# Altium schematic sheet MicroSpecSensorBoard_Connectors_V2_1.SchDoc: Extension connectors
size A4; DocumentNumber: MB1136; Revision: C.3; SheetNumber: 4; SheetTotal: 4; Project: NUCLEO-XXXXRX
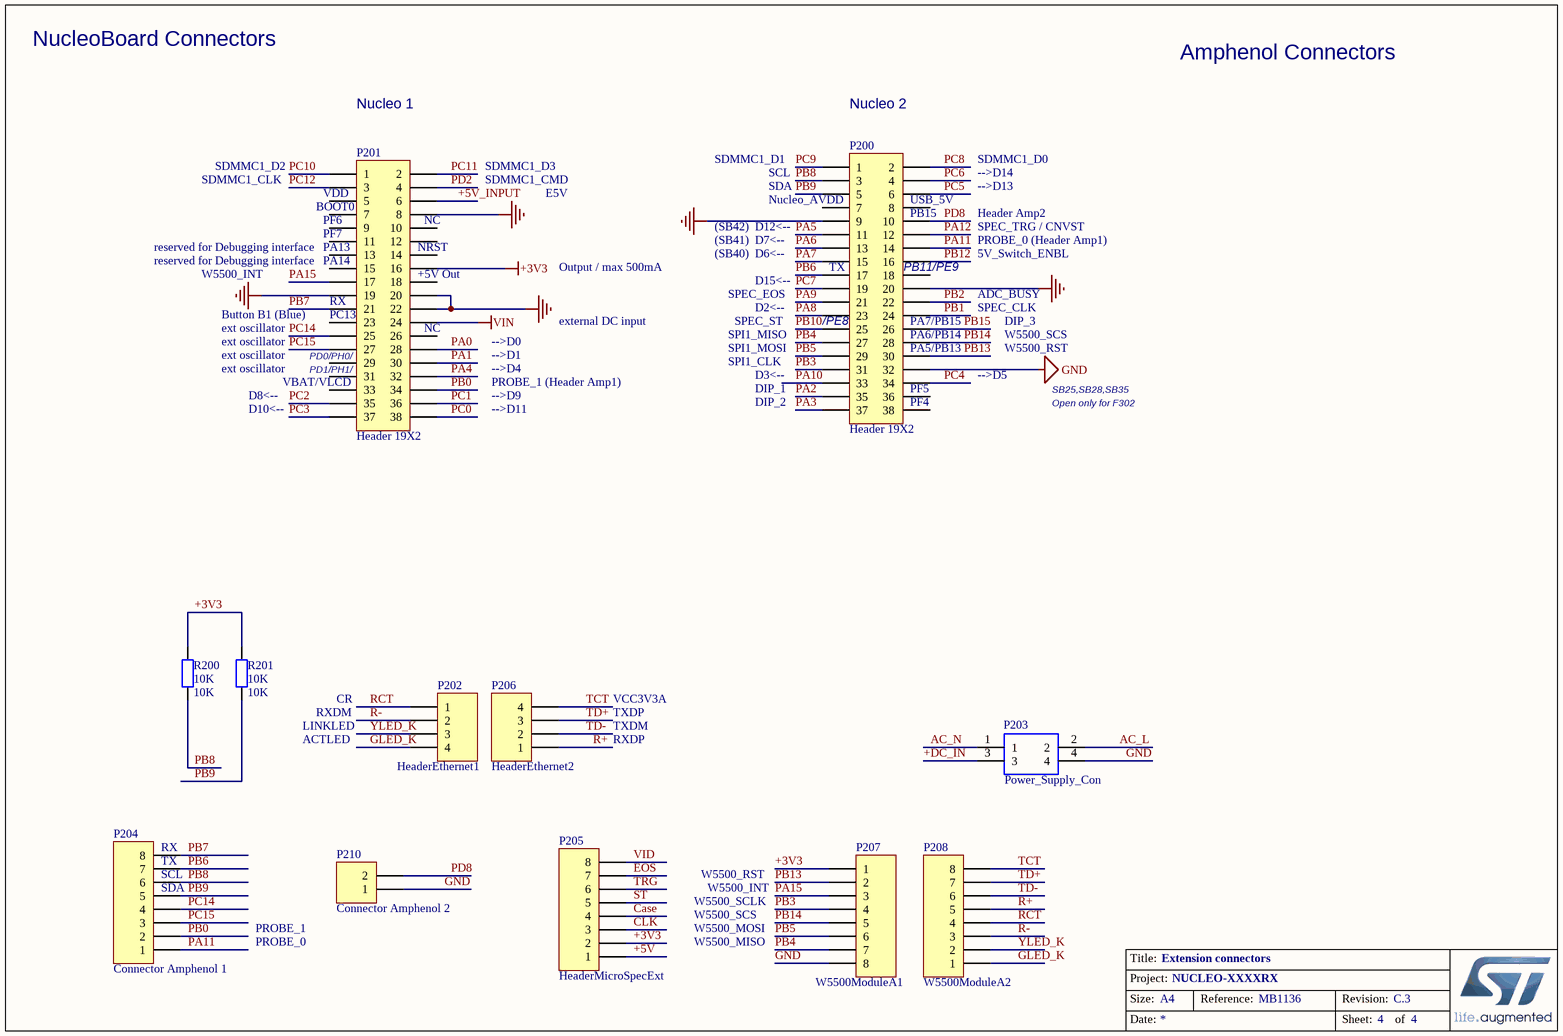
[diagram p0: MicroSpecSensorBoard_Connectors_V2_1.SchDoc]

## Parts
P200  Header 19X2  [HDR2X19]
P201  Header 19X2  [HDR2X19]
P202  HeaderEthernet1  [HDR1X4]
P203  Power_Supply_Con  [1864053]
P204  Connector Amphenol 1  [HDR1X8 - phoenix]
P205  HeaderMicroSpecExt  [HDR1X8]
P206  HeaderEthernet2  [HDR1X4]
P207  W5500ModuleA1  [HDR1X8]
P208  W5500ModuleA2  [HDR1X8]
P210  Connector Amphenol 2  [HDR1X2 - phoenix]
R200  10K  [6-0805_L]
R201  10K  [6-0805_L]

## Nets
+3V3: P201.16 P205.2 P207.1 R200.2 R201.2
GND: P200.9 P200.20 P200.32 P201.8 P201.19 P201.20 P201.22 P203.4 P207.8 P210.1
VIN: P201.24
+5V: P205.1
+5V_INPUT: P201.6
+DC_IN: P203.3
AC_L: P203.2
AC_N: P203.1
Case: P205.4
CLK: P205.3
EOS: P205.7
GLED_K: P202.4 P208.1
PA0: P201.28
PA1: P201.30
PA2: P200.35
PA3: P200.37
PA4: P201.32
PA5: P200.11
PA6: P200.13
PA7: P200.15
PA8: P200.23
PA9: P200.21
PA10: P200.33
PA11: P200.14 P204.1
PA12: P200.12
PA15: P201.17 P207.3
PB0: P201.34 P204.2
PB1: P200.24
PB2: P200.22
PB3: P200.31 P207.4
PB4: P200.27 P207.7
PB5: P200.29 P207.6
PB6: P200.17 P204.7
PB7: P201.21 P204.8
PB8: P200.3 P204.6 R200.1
PB9: P200.5 P204.5 R201.1
PB10: P200.25
PB12: P200.16
PB13: P200.30 P207.2
PB14: P200.28 P207.5
PB15: P200.26
PC0: P201.38
PC1: P201.36
PC2: P201.35
PC3: P201.37
PC4: P200.34
PC5: P200.6
PC6: P200.4
PC7: P200.19
PC8: P200.2
PC9: P200.1
PC10: P201.1
PC11: P201.2
PC12: P201.3
PC14: P201.25 P204.4
PC15: P201.27 P204.3
PD2: P201.4
PD8: P200.10 P210.2
R+: P206.1 P208.5
R-: P202.2 P208.3
RCT: P202.1 P208.4
ST: P205.5
TCT: P206.4 P208.8
TD+: P206.3 P208.7
TD-: P206.2 P208.6
TRG: P205.6
VID: P205.8
YLED_K: P202.3 P208.2

Not connected (* = marked no-connect by the designer): P200 7 8 18 36 38; P201 5 7 9 10 11 12 13 14 15 18 23 26 29 31 33

## Notes on the sheet
- NucleoBoard Connectors
- Nucleo 1
- Nucleo 2
- Amphenol Connectors
- SDMMC1_D2
- SDMMC1_D3
- SDMMC1_D1
- SCL
- SDMMC1_D0
- -->D14
- (near P201) reserved for Debugging interface
- SDMMC1_CLK
- (near P201) BOOT0
- (near P201) VDD
- (near P201) PF6
- (near P201) PF7
- (near P201) PA13
- (near P201) NRST
- (near P201) NC
- SDMMC1_CMD
- E5V
- (SB42)
- (SB41)
- D7<--
- D12<--
- SDA
- (near P200) Nucleo_AVDD
- (near P200) USB_5V
- (near P200) PB15
- -->D13
- SPEC_TRG / CNVST
- PROBE_0 (Header Amp1)
- Header Amp2
- W5500_INT
- (near P201) PA14
- (near P201) RX
- (near P201) +5V Out
- Output / max 500mA
- (SB40)
- SPEC_EOS
- D15<--
- D6<--
- D2<--
- (near P200) TX
- (near P200) PB11/PE9
- 5V_Switch_ENBL
- ADC_BUSY
- SPEC_CLK
- (near P201) ext oscillator
- (near P201) Button B1 (Blue)
- (near P201) VBAT/VLCD
- (near P201) PD0/PH0/
- (near P201) PD1/PH1/
- (near P201) PC13
- PROBE_1 (Header Amp1)
- -->D4
- -->D1
- -->D0
- external DC input
- SPI1_MISO
- SPI1_MOSI
- SPI1_CLK
- SPEC_ST
- D3<--
- (near P200) /PE8
- (near P200) PA7/PB15
- (near P200) PA6/PB14
- (near P200) PA5/PB13
- -->D5
- DIP_3
- W5500_SCS
- W5500_RST
- D8<--
- D10<--
- -->D11
- -->D9
- DIP_2
- DIP_1
- (near P200) PF5
- (near P200) PF4
- Open only for F302
- SB25,SB28,SB35
- RXDM
- CR
- VCC3V3A
- TXDP
- LINKLED
- ACTLED
- TXDM
- RXDP
- (near P204) RX
- (near P204) SCL
- (near P204) SDA
- (near P204) TX
- W5500_SCLK
- PROBE_1
- PROBE_0
- W5500_MOSI
- W5500_MISO
- Title:
- Project:
- Size:
- Date:
- A4
- Reference:
- Sheet:
- Revision:
- of

## Library data of the parts
P200 P201 = Header 19X2: Header, 19-Pin, Dual row; LatestRevisionDate: 17-Jul-2002; LatestRevisionNote: Re-released for DXP Platform.; Publisher: Altium Limited
P202 P206 = Header 4: Header, 4-Pin; LatestRevisionDate: 17-Jul-2002; LatestRevisionNote: Re-released for DXP Platform.; Publisher: Altium Limited
P203 = 1864053: Push spring connector 5mm pitch 4 way Phoenix Contact SDC Series 5mm Pitch Straight Pluggable Terminal Block, Plug with Plug In Termination, PCB Mount, 4 Way; Geometry.Height: 16mm; RS Part Number: 1113745; Manufacturer_Name: Phoenix Contact; Manufacturer_Part_Number: 1864053; Datasheet Link: http://uk.rs-online.com/web/p/products/1113745
P204 = MHDR1X8: Header, 8-Pin Phönix Contact; LatestRevisionDate: 17-Jul-2002; LatestRevisionNote: Re-released for DXP Platform.; Publisher: Altium Limited
P205 P207 P208 = Header 8: Header, 8-Pin; LatestRevisionDate: 17-Jul-2002; LatestRevisionNote: Re-released for DXP Platform.; Publisher: Altium Limited
P210 = MHDR1X2: Header, 2-Pin, MKDSN1,5 / 2, Phönix Contact; Publisher: UFZ Leipzig
R200 R201 = Res2: Resistor; Published: 8-Jun-2000; LatestRevisionDate: 17-Jul-2002; LatestRevisionNote: Re-released for DXP Platform.; PackageReference: AXIAL-0.4; Publisher: Altium Limited; PackageDescription: Axial Device, Thru-Hole; 2 Leads; 0.4 in Pin Spacing; Value: 10K